# Altium schematic sheet motor_drive.SchDoc
size A4; Organization: GPA Robotics; Revision: REV 0
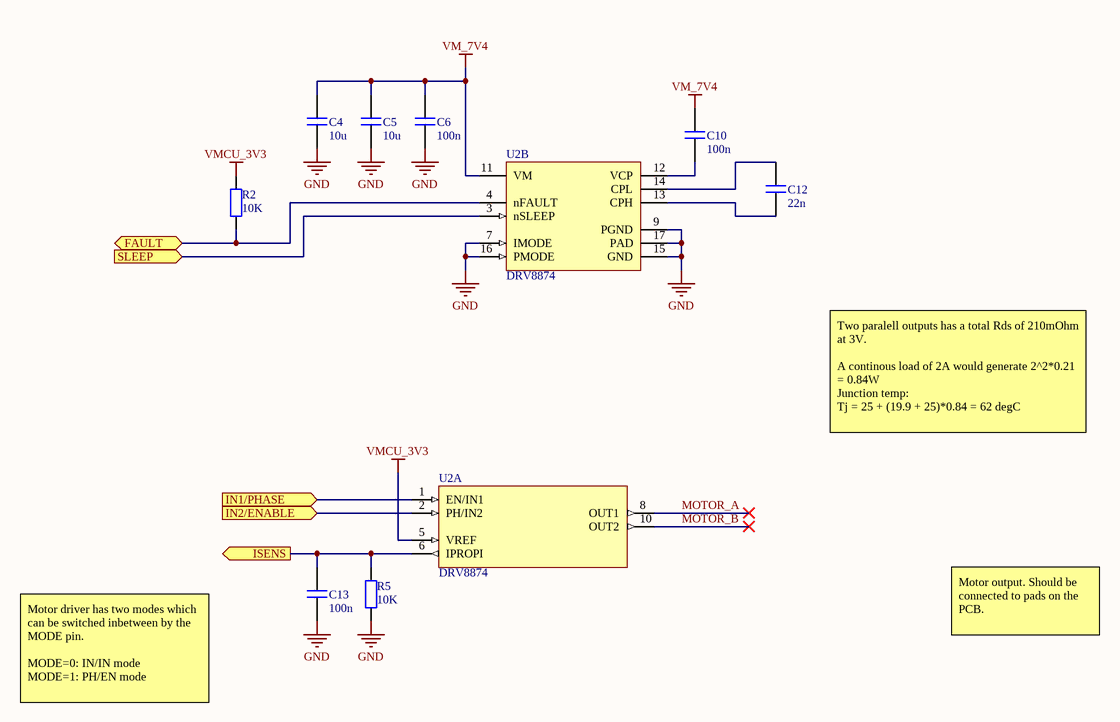
[diagram p0: motor_drive.SchDoc]

## Parts
C4  value 10u  [CAPC3216X14N]  (hidden comment: cap)
C5  value 10u  [CAPC3216X14N]  (hidden comment: cap)
C6  value 100n  [CAPC1005X06N]  (hidden comment: cap)
C10  value 100n  [CAPC1005X06N]  (hidden comment: cap)
C12  value 22n  [CAPC1005X06N]  (hidden comment: cap)
C13  value 100n  [CAPC1005X06N]  (hidden comment: cap)
R2  value 10K  [RESC1005X04N]  (hidden comment: res)
R5  value 10K  [RESC1005X04N]  (hidden comment: res)
U2  DRV8874  [TSOP65P640X120_HS-17N_DRV8874]  (parts A,B of 2)

## Ports
FAULT (bidir), IN1/PHASE (in), IN2/ENABLE (in), ISENS (out), SLEEP (in)

## Nets
GND: C4.1 C5.1 C6.1 C13.1 R5.1 U2.7(IMODE) U2.9(PGND) U2.15(GND) U2.16(PMODE) U2.17(PAD)
VM_7V4: C4.2 C5.2 C6.2 C10.2 U2.11(VM)
VMCU_3V3: R2.2 U2.5(VREF)
FAULT: R2.1 U2.4(nFAULT) ; port FAULT
IN1/PHASE: U2.1(EN/IN1) ; port IN1/PHASE
IN2/ENABLE: U2.2(PH/IN2) ; port IN2/ENABLE
ISENS: C13.2 R5.2 U2.6(IPROPI) ; port ISENS
MOTOR_A: U2.8(OUT1)
MOTOR_B: U2.10(OUT2)
SLEEP: U2.3(nSLEEP) ; port SLEEP
NetC10_1: C10.1 U2.12(VCP)
NetC12_1: C12.1 U2.13(CPH)
NetC12_2: C12.2 U2.14(CPL)

## Notes on the sheet
- Two paralell outputs has a total Rds of 210mOhm at 3V.
  A continous load of 2A would generate 2^2*0.21 = 0.84W
  Junction temp:
  Tj = 25 + (19.9 + 25)*0.84 = 62 degC
- Motor output. Should be connected to pads on the PCB.
- Motor driver has two modes which can be switched inbetween by the MODE pin.
  MODE=0: IN/IN mode
  MODE=1: PH/EN mode
- Title
- Size:
- Date:
- A4
- Number:
- Time:
- Revision:
- Sheet
- of
- Repo:

## Library data of the parts
C4-C6 C10 C12 C13 = cap: Capacitor; voltage: *; type: *; #digikey: *; #mouser: *
R2 R5 = res: Resistor; power: *; voltage: *; #digikey: *; #mouser: *
U2 = drv8874: H-Bridge Motor Driver With Integrated Current Sense and Regulation; ComponentLink1Description: Datasheet; ComponentLink1URL: http://www.ti.com/lit/gpn/drv8874